# Altium schematic sheet FLATSAT002.SchDoc: Title Block Template
size A2; Engineer: M. BRINDLEY; Organization: BLUEsat Project; Address1: Room 419; Address2: School of EE&T; Address3: UNSW, NSW 2052; Address4: Australia; DocumentNumber: TITL0001; Description: Sample Title Block; Version: 1.0
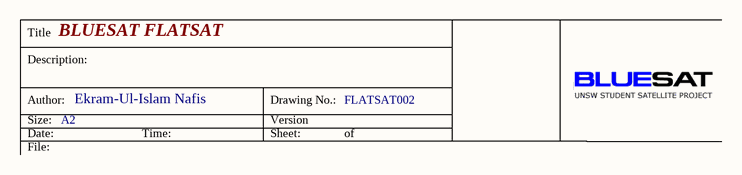
[diagram p0: FLATSAT002.SchDoc]

## Notes on the sheet
- Title
- Description:
- BLUESAT FLATSAT
- Size:
- Author:
- Date:
- File:
- A2
- Ekram-Ul-Islam Nafis
- Time:
- Version
- Sheet:
- Drawing No.:
- FLATSAT002
- of